# Altium project Handheld99.PrjPcb (part 2 of 3)

## Sheet RADIO.SchDoc: uBlox Radio
size A4; Organization: Altium Limited; Address1: L3, 12a Rodborough Rd; Address2: Frenchs Forest; Address3: NSW; Address4: Australia 2086
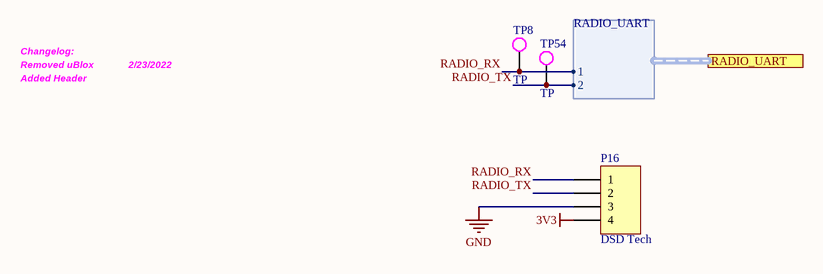
[diagram p16: RADIO.SchDoc]

### Parts
P16  DSD Tech  [HDR1X4]
TP8  TP  [Test_point]
TP54  TP  [Test_point]

### Ports
RADIO_UART (harness RADIO_UART)

### Harnesses
RADIO_UART: 1, 2

### Nets
3V3: P16.4
GND: P16.3
RADIO_RX: P16.1 TP8.1 ; port RADIO_UART.1
RADIO_TX: P16.2 TP54.1 ; port RADIO_UART.2

### Notes on the sheet
- Changelog:
- Removed uBlox
- Added Header
- 2/23/2022
- Title
- Date:
- RE:
- Arturo di Girolamo
- Size:
- A3
- A

### Library data of the parts
P16 = Header 4: Header, 4-Pin; LatestRevisionDate: 17-Jul-2002; LatestRevisionNote: Re-released for DXP Platform.; Publisher: Altium Limited
TP8 TP54 = TP_PCB: Test Point

## Sheet LOINA.SchDoc: DDS INA
size A4; Organization: Altium Limited; Address1: L3, 12a Rodborough Rd; Address2: Frenchs Forest; Address3: NSW; Address4: Australia 2086
Used 4 times, as channels LO1_INA1, LO1_INA2, LO2_INA1, LO2_INA2. Parts and nets are listed once, with the designators drawn on the sheet.
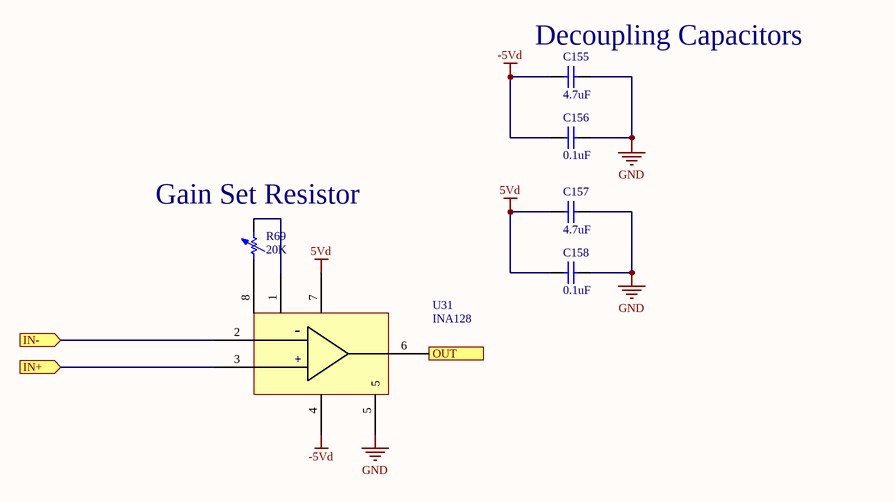
[diagram p17: LOINA.SchDoc]

### Parts
C155  4.7uF  [0402_Cap]
C156  0.1uF  [0402_Cap]
C157  4.7uF  [0402_Cap]
C158  0.1uF  [0402_Cap]
R69  20K  [TRIMRES]
U31  INA128  [SOIC_8]

### Ports
IN+ (in), IN- (in), OUT (out)

### Nets
5Vd: C157.1 C158.1 U31.7
-5Vd: C155.1 C156.1 U31.4
GND: C155.2 C156.2 C157.2 C158.2 U31.5
IN+: U31.3 ; port IN+
IN-: U31.2 ; port IN-
OUT: U31.6 ; port OUT
NetR69_1: R69.1 U31.8(Gain)
NetR69_2: R69.2 U31.1(Gain)

### Channels
LO1_INA1: designators end in _LO1_INA1; ports IN+=NetR28_LO1_1 IN-=NetR29_LO1_1 OUT=NetJ5_07
LO1_INA2: designators end in _LO1_INA2; ports IN+=NetR19_LO1_1 IN-=NetR27_LO1_1 OUT=NetR18_2
LO2_INA1: designators end in _LO2_INA1; ports IN+=NetR28_LO2_1 IN-=NetR29_LO2_1 OUT=NetJ5_08
LO2_INA2: designators end in _LO2_INA2; ports IN+=NetR19_LO2_1 IN-=NetR27_LO2_1 OUT=NetR17_2

### Notes on the sheet
- (near C155) Decoupling Capacitors
- (near R69) Gain Set Resistor
- Title
- Date:
- RE:
- Arturo di Girolamo
- Size:
- A3
- A
- (in symbol INA128UA/2K5) -; +

### Library data of the parts
C155 C157 = CL21A475KAQNNNE: as C42 on sheet buffer; MFGPN: CL21A475KAQNNNE
C156 C158 = CL21B104KACNNNC: as C1 on sheet mcu; MFGPN: CL21B104KACNNNC
R69 = PV36W102C01B00_RES: Variable resistor 1k; MFGPN: PV36W102C01B00
U31 = INA128UA/2K5: Instrumentation Amp, Generic; ASYPN: INA828IDR; MFGPN: INA128UA/2K5

## Sheet 50Hz_GEN_LPF.SchDoc: 50 Hz Sine Gen LPF
size A4; Organization: Altium Limited; Address1: L3, 12a Rodborough Rd; Address2: Frenchs Forest; Address3: NSW; Address4: Australia 2086
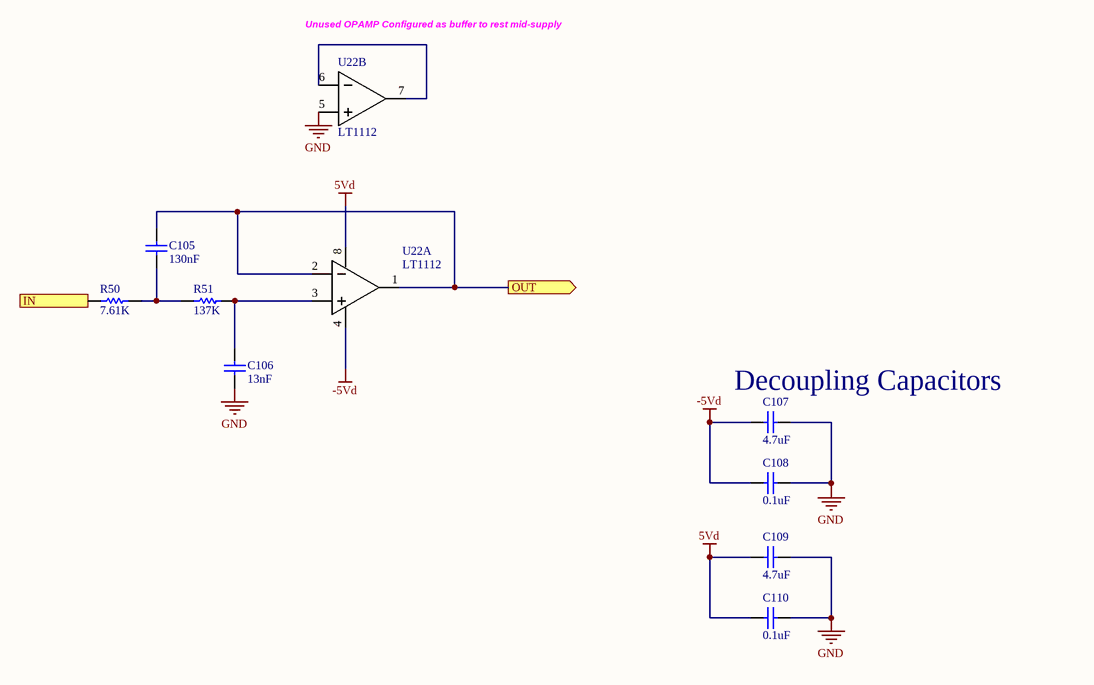
[diagram p18: 50Hz_GEN_LPF.SchDoc]

### Parts
C105  130nF  [0402_Cap]
C106  13nF  [0402_Cap]
C107  4.7uF  [0402_Cap]
C108  0.1uF  [0402_Cap]
C109  4.7uF  [0402_Cap]
C110  0.1uF  [0402_Cap]
R50  7.61K  [0402_Res]
R51  137K  [0402_Res]
U22  LT1112  [SOIC_8]  (parts A,B of 2)

### Ports
IN (in), OUT (out)

### Nets
5Vd: C109.1 C110.1 U22.8
-5Vd: C107.1 C108.1 U22.4
GND: C106.1 C107.2 C108.2 C109.2 C110.2 U22.5
NetC105_1: C105.1 R50.2 R51.1
NetC105_2: C105.2 U22.1 U22.2 ; port OUT
NetC106_2: C106.2 R51.2 U22.3
NetR17_1: R50.1 ; port IN
NetU22_6: U22.6 U22.7

### Notes on the sheet
- Unused OPAMP Configured as buffer to rest mid-supply
- (near C107) Decoupling Capacitors
- Title
- Date:
- RE:
- Arturo di Girolamo
- Size:
- A3
- A

### Library data of the parts
C105 = 08051C163JAT2A: Capacitor, 16nF, 0805, 25V; ASYPN: GRM155R61A124KE19D; Value: 16nF; MFGPN: 08051C163JAT2A
C106 = GRM2165C2A162JA01D: Capacitor, 1.6nF, 0805, 25V; ASYPN: C0402C123K8PACTU; Value: 1.6nF; MFGPN: GRM2165C2A162JA01D
C107 C109 = CL21A475KAQNNNE: as C42 on sheet buffer; MFGPN: CL21A475KAQNNNE
C108 C110 = CL21B104KACNNNC: as C1 on sheet mcu; MFGPN: CL21B104KACNNNC
R50 = RC0805FR-071K65L: 1.65k; ASYPN: MCS0402MD7501BE100; Value: 1.65k; MFGPN: RC0805FR-071K65L
R51 = RC0805FR-075K9L: 5.9k; ASYPN: RMCF0402FT137K; Value: 5.9k; MFGPN: RC0805FR-075K9L
U22 = LT1112: ASYPN: LT1112IS8#PBF

## Sheet 5kHz_GEN_LPF.SchDoc: 5kHz Sine Gen LPF
size A4; Organization: Altium Limited; Address1: L3, 12a Rodborough Rd; Address2: Frenchs Forest; Address3: NSW; Address4: Australia 2086
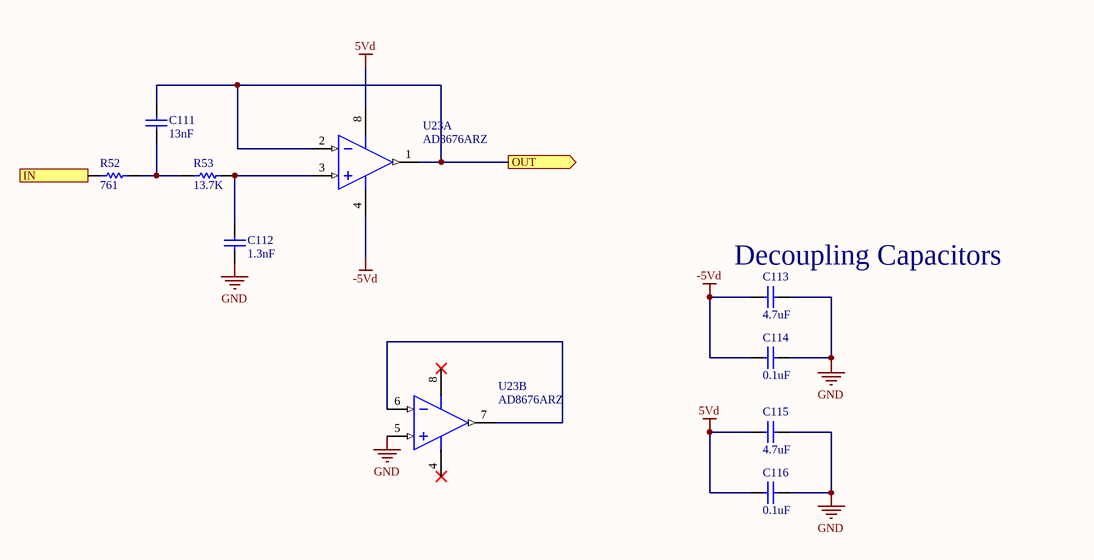
[diagram p19: 5kHz_GEN_LPF.SchDoc]

### Parts
C111  13nF  [0402_Cap]
C112  1.3nF  [0402_Cap]
C113  4.7uF  [0402_Cap]
C114  0.1uF  [0402_Cap]
C115  4.7uF  [0402_Cap]
C116  0.1uF  [0402_Cap]
R52  761  [0402_Res]
R53  13.7K  [0402_Res]
U23  AD8676ARZ  [ADI-R-8_M]  (parts A,B of 2)

### Ports
IN (in), OUT (out)

### Nets
5Vd: C115.1 C116.1 U23.8(+V)
-5Vd: C113.1 C114.1 U23.4(-V)
GND: C112.1 C113.2 C114.2 C115.2 C116.2 U23.5(+IN_B)
NetC111_1: C111.1 R52.2 R53.1
NetC111_2: C111.2 U23.1(OUT_A) U23.2(-IN_A) ; port OUT
NetC112_2: C112.2 R53.2 U23.3(+IN_A)
NetR18_1: R52.1 ; port IN
NetU23_6: U23.6(-IN_B) U23.7(OUT_B)

### Notes on the sheet
- (near C113) Decoupling Capacitors
- Title
- Date:
- RE:
- Arturo di Girolamo
- Size:
- A3
- A

### Library data of the parts
C111 = 08051C163JAT2A: Capacitor, 16nF, 0805, 25V; ASYPN: C0402C123K8PACTU; Value: 16nF; MFGPN: 08051C163JAT2A
C112 = GRM2165C2A162JA01D: Capacitor, 1.6nF, 0805, 25V; ASYPN: GRM1557U1A122JA01D; Value: 1.6nF; MFGPN: GRM2165C2A162JA01D
C113 C115 = CL21A475KAQNNNE: as C42 on sheet buffer; MFGPN: CL21A475KAQNNNE
C114 C116 = CL21B104KACNNNC: as C1 on sheet mcu; MFGPN: CL21B104KACNNNC
R52 = RC0805FR-071K65L: 1.65k; ASYPN: ERA-2AEB7680X; Value: 1.65k; MFGPN: RC0805FR-071K65L
R53 = RC0805FR-075K9L: 5.9k; ASYPN: RMCF0402FT13K7; Value: 5.9k; MFGPN: RC0805FR-075K9L
U23 = CMP-0384-01145-2: Double Channel Wide Bandwidth Operational Amplifier, 10 MHz BW, 2.5 V/us SR, Industrial, 8-pin SOIC (R-8), Tube; Generic Part Number: AD8676; Manufacturer: Analog Devices; Input Offset Voltage: 12uV; Input Bias Current: 2.4nA; V Span Min: 10V; Iq/Amp: 2.7mA; V Span Max: 36V; Small Signal Bandwidth: 10MHz; Amplifiers Per Package: 2; Code_JEDEC: MS-012-AA; Mounting Technology: Surface Mount; Slew Rate: 2.5V/us; DatasheetVersion: Rev. C; ComponentLink2Description: Datasheet; ComponentLink3Description: Package Specification; PackageReference: R-8; ComponentLink1URL: http://www.analog.com/en/index.html; RevisionNote: Reference Circuit URL fixed; ComponentLink1Description: Manufacturer URL; ComponentLink2URL: http://www.analog.com/static/imported-files/data_sheets/AD8676.pdf; ComponentLink3URL: http://www.analog.com/static/imported-files/packages/PKG_PDF/SOIC_Narrow%20(R)/R_8.pdf; ComponentLink4Description: Reference Circuit; ComponentLink4URL: http://www.analog.com/en/all-operational-amplifiers-op-amps/operational-amplifiers-op-amps/ad8676/products/product.html#product-recommendations; PackageDescription: 8-Pin Standard Small Outline Package, Body 3.9 x 4.9 mm, Pitch 1.27 mm; PartNumber: AD8676ARZ; PackageVersion: 060506-A; ASYPN: AD8676ARZ

## Sheet low_pass.SchDoc: 4TH ORDER LOWPASS
size A4; Organization: Altium Limited; Address1: L3, 12a Rodborough Rd; Address2: Frenchs Forest; Address3: NSW; Address4: Australia 2086; DocumentNumber: 1; Revision: 1
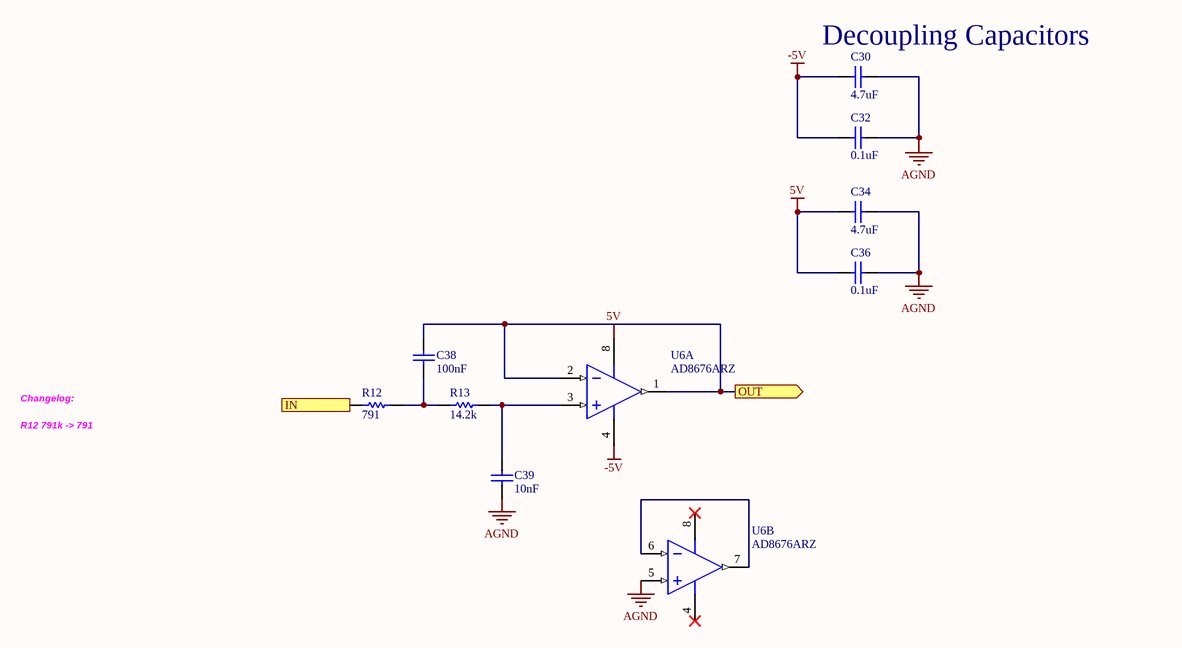
[diagram p20: low_pass.SchDoc]

### Parts
C30  4.7uF  [0402_Cap]
C32  0.1uF  [0402_Cap]
C34  4.7uF  [0402_Cap]
C36  0.1uF  [0402_Cap]
C38  100nF  [0402_Cap]
C39  10nF  [0402_Cap]
R12  791  [0402_Res]
R13  14.2k  [0402_Res]
U6  AD8676ARZ  [ADI-R-8_M]  (parts A,B of 2)

### Ports
IN (in), OUT (out)

### Nets
5V: C34.1 C36.1 U6.8(+V)
-5V: C30.1 C32.1 U6.4(-V)
AGND: C30.2 C32.2 C34.2 C36.2 C39.1 U6.5(+IN_B)
NetC38_1: C38.1 R12.2 R13.1
NetC38_2: C38.2 U6.1(OUT_A) U6.2(-IN_A) ; port OUT
NetC39_2: C39.2 R13.2 U6.3(+IN_A)
NetR10_HP2_2: R12.1 ; port IN
NetU6_6: U6.6(-IN_B) U6.7(OUT_B)

### Notes on the sheet
- (near C30) Decoupling Capacitors
- Changelog:
- R12 791k -> 791
- Title
- Date:
- RE:
- Arturo di Girolamo
- Size:
- A3
- A

### Library data of the parts
C30 C34 = CL21A475KAQNNNE: as C42 on sheet buffer; MFGPN: CL21A475KAQNNNE
C32 C36 = CL21B104KACNNNC: as C1 on sheet mcu; MFGPN: CL21B104KACNNNC
C38 = 08051C163JAT2A: Capacitor, 16nF, 0805, 25V; ASYPN: 0402YC104KAT2A; Value: 16nF; MFGPN: 08051C163JAT2A
C39 = GRM2165C2A162JA01D: Capacitor, 1.6nF, 0805, 25V; ASYPN: 0402B103K6R3CT; Value: 1.6nF; MFGPN: GRM2165C2A162JA01D
R12 = RC0805FR-071K65L: 1.65k; ASYPN: RMCF0402FT787K; Value: 1.65k; MFGPN: RC0805FR-071K65L
R13 = RC0805FR-075K9L: 5.9k; ASYPN: TNPW040214K2BEED; Value: 5.9k; MFGPN: RC0805FR-075K9L
U6 = CMP-0384-01145-2: as U23 on sheet 5kHz_GEN_LPF; Code_JEDEC: MS-012-AA; Mounting Technology: Surface Mount; Slew Rate: 2.5V/us; DatasheetVersion: Rev. C; ComponentLink2Description: Datasheet; ComponentLink3Description: Package Specification; PackageReference: R-8; ComponentLink1URL: http://www.analog.com/en/index.html; RevisionNote: Reference Circuit URL fixed; ComponentLink1Description: Manufacturer URL; ComponentLink2URL: http://www.analog.com/static/imported-files/data_sheets/AD8676.pdf; ComponentLink3URL: http://www.analog.com/static/imported-files/packages/PKG_PDF/SOIC_Narrow%20(R)/R_8.pdf; ComponentLink4Description: Reference Circuit; ComponentLink4URL: http://www.analog.com/en/all-operational-amplifiers-op-amps/operational-amplifiers-op-amps/ad8676/products/product.html#product-recommendations; PackageDescription: 8-Pin Standard Small Outline Package, Body 3.9 x 4.9 mm, Pitch 1.27 mm; PartNumber: AD8676ARZ; PackageVersion: 060506-A; ASYPN: AD8676ARZ

## Sheet 3v3_Regulator.SchDoc: 3.3 Regulator
size A4; Organization: Altium Limited; Address1: L3, 12a Rodborough Rd; Address2: Frenchs Forest; Address3: NSW; Address4: Australia 2086
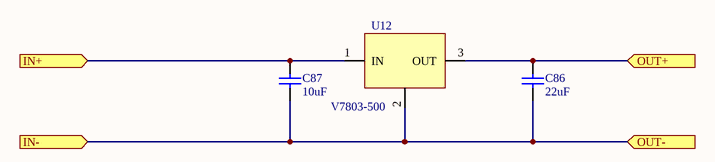
[diagram p21: 3v3_Regulator.SchDoc]

### Parts
C86  22uF  [STD_0805_C]
C87  10uF  [STD_0805_C]
U12  V7803-500  [V78-500]

### Ports
IN+ (in), IN- (in), OUT+ (in), OUT- (in)

### Nets
3V3: C86.2 U12.3(OUT) ; port OUT+
24V: C87.2 U12.1(IN) ; port IN+
GND: C86.1 C87.1 U12.2(GND) ; port IN-, port OUT-

### Notes on the sheet
- Title
- Date:
- RE:
- Arturo di Girolamo
- Size:
- A3
- A

### Library data of the parts
C86 C87 = GRM21BR61E226ME44L: Capacitor, 22uF, 0805, 25V; Value: .01uf; ASYPN: C2012X5R1V226M125AC; MFGPN: GRM21BR61E226ME44L

## Sheet ADC_Reference.SchDoc: ADC Reference
size A4; Organization: Altium Limited; Address1: L3, 12a Rodborough Rd; Address2: Frenchs Forest; Address3: NSW; Address4: Australia 2086
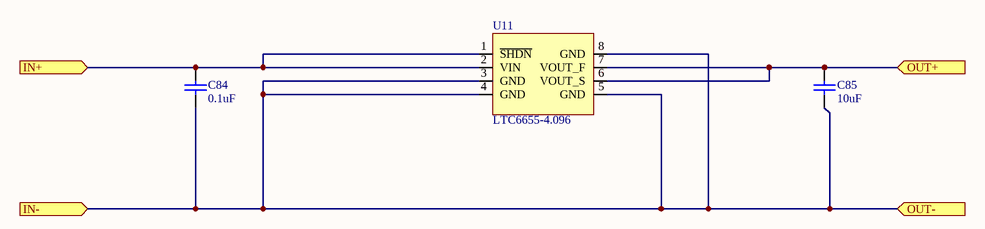
[diagram p22: ADC_Reference.SchDoc]

### Parts
C84  0.1uF  [0402_Cap]
C85  10uF  [0402_Cap]
U11  LTC6655-4.096  [MSOP_8]

### Ports
IN+ (in), IN- (in), OUT+ (in), OUT- (in)

### Nets
5V: C84.2 U11.1(~{SHDN}) U11.2(VIN) ; port IN+
AGND: C84.1 C85.1 U11.3(GND) U11.4(GND) U11.5(GND) U11.8(GND) ; port OUT-, port IN-
REF: C85.2 U11.6(VOUT_S) U11.7(VOUT_F) ; port OUT+

### Notes on the sheet
- Title
- Date:
- RE:
- Arturo di Girolamo
- Size:
- A3
- A

### Library data of the parts
C84 = CL21B104KACNNNC: as C1 on sheet mcu; MFGPN: CL21B104KACNNNC
C85 = CL21A106KAFN3NE: Capacitor, 10uF, 0805; Value: .01uf; ASYPN: CL05A106MQ5NUNC; MFGPN: CL21A106KAFN3NE
U11 = LTC6655CHMS8-4.096#PBF: Voltage Reference 4.096V; MFGPN: LTC6655CHMS8-4.096#PBF; ASYPN: LTC6655CHMS8-4.096#PBF

## Sheet 2v5_Regulator.SchDoc: 2.5V ADC Regulator
size A4; Organization: Altium Limited; Address1: L3, 12a Rodborough Rd; Address2: Frenchs Forest; Address3: NSW; Address4: Australia 2086
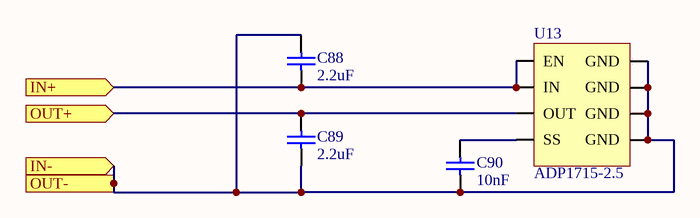
[diagram p23: 2v5_Regulator.SchDoc]

### Parts
C88  2.2uF  [0402_Cap]
C89  2.2uF  [0402_Cap]
C90  10nF  [0402_Cap]
U13  ADP1715-2.5  [MSOP_8]

### Ports
IN+ (in), IN- (in), OUT+ (in), OUT- (in)

### Nets
2V5: C89.2 U13.3(OUT) ; port OUT+
5V: C88.1 U13.1(EN) U13.2(IN) ; port IN+
AGND: C88.2 C89.1 C90.1 U13.5(GND) U13.6(GND) U13.7(GND) U13.8(GND) ; port OUT-, port IN-
NetC90_2: C90.2 U13.4(SS)

### Notes on the sheet
- Title
- Date:
- RE:
- Arturo di Girolamo
- Size:
- A3
- A

### Library data of the parts
C88 C89 = CL21A225KAFNNNE: Capacitor, 2.2uF, 0805; Value: .01uf; ASYPN: CL05A225KP5NNNC; MFGPN: CL21A225KAFNNNE
C90 = C0805C103K1RAC7210: Capacitor, 10nF, 0805; Value: .01uf; ASYPN: 0402B103K6R3CT; MFGPN: C0805C103K1RAC7210
U13 = ADP1715ARMZ-2.5-R7: 2.5V linear regulator; MFGPN: ADP1715ARMZ-2.5-R7; ASYPN: ADP1715ARMZ-2.5-R7

## Sheet 5v_Regulator.SchDoc: 5V Battery Regulator
size A4; Organization: Altium Limited; Address1: L3, 12a Rodborough Rd; Address2: Frenchs Forest; Address3: NSW; Address4: Australia 2086
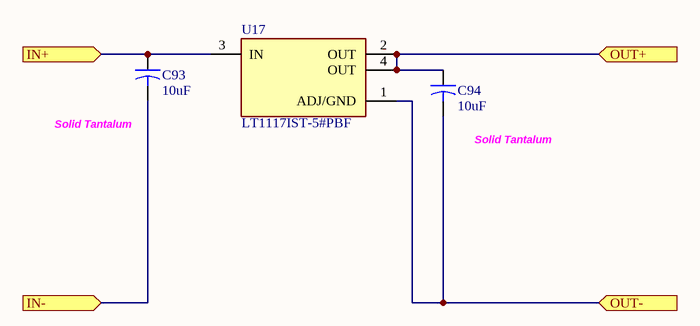
[diagram p24: 5v_Regulator.SchDoc]

### Parts
C93  10uF  [Tantalum_2917]
C94  10uF  [Tantalum_2917]
U17  LT1117IST-5#PBF  [REG_LT1117IST-5#PBF]

### Ports
IN+ (in), IN- (in), OUT+ (in), OUT- (in)

### Nets
5V: C94.1 U17.2(OUT) U17.4(OUT) ; port OUT+
AGND: C94.2 U17.1(ADJ/GND) ; port OUT-
NetC93_1: C93.1 U17.3(IN) ; port IN+
NetC93_2: C93.2 ; port IN-

### Notes on the sheet
- (near C93) Solid Tantalum
- (near C94) Solid Tantalum
- Title
- Date:
- RE:
- Arturo di Girolamo
- Size:
- A3
- A

### Library data of the parts
C93 C94 = UVR1V102MHD1TO: Capacitor, 100uF NICHICON; ASYPN: T495D106K035ATE260; MFGPN: UVR1V102MHD1TO
U17 = LT1117IST-5#PBF: LDO Regulator Pos 5V 0.8A Automotive 4-Pin_3+Tab_ SOT-223 Tube; MF: Analog Devices; Value: *; Availability: Unavailable; Price: None; MP: LT1117IST-5#PBF; Package: SOT-223-3 Analog Devices; SnapEDA_Link: https://www.snapeda.com/parts/LT1117IST-5%23PBF/Analog%20Devices/view-part/4348177/?ref=snap; ASYPN: LT1117IST-5#PBF; Parameter 1: *

## Sheet -5v_Regulator.SchDoc: -5V Battery Regulator
size A4; Organization: Altium Limited; Address1: L3, 12a Rodborough Rd; Address2: Frenchs Forest; Address3: NSW; Address4: Australia 2086
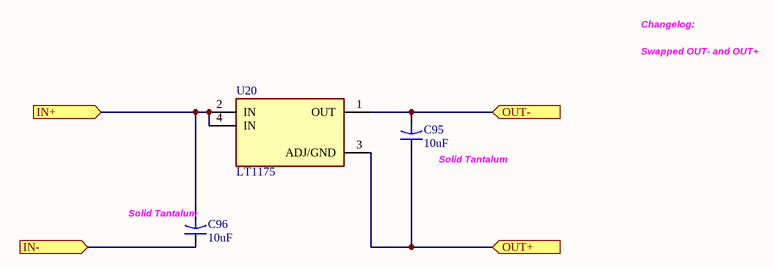
[diagram p25: -5v_Regulator.SchDoc]

### Parts
C95  10uF  [Tantalum_2917]
C96  10uF  [Tantalum_2917]
U20  LT1175  [REG_LT1117IST-5#PBF]

### Ports
IN+ (in), IN- (in), OUT+ (in), OUT- (in)

### Nets
-5V: C95.2 U20.1(OUT) ; port OUT-
AGND: C95.1 U20.3(ADJ/GND) ; port OUT+
NetC93_2: C96.2 U20.2(IN) U20.4(IN) ; port IN+
NetC96_1: C96.1 ; port IN-

### Notes on the sheet
- Changelog:
- Swapped OUT- and OUT+
- (near C95) Solid Tantalum
- (near C96) Solid Tantalum
- Title
- Date:
- RE:
- Arturo di Girolamo
- Size:
- A3
- A

### Library data of the parts
C95 C96 = UVR1V102MHD1TO: as C93 on sheet 5v_Regulator; MFGPN: UVR1V102MHD1TO
U20 = LT1175: ASYPN: LT1175IST-5#TRPBF

## Sheet Power_Input.SchDoc: Power Input PCB
size A4; Organization: Altium Limited; Address1: L3, 12a Rodborough Rd; Address2: Frenchs Forest; Address3: NSW; Address4: Australia 2086
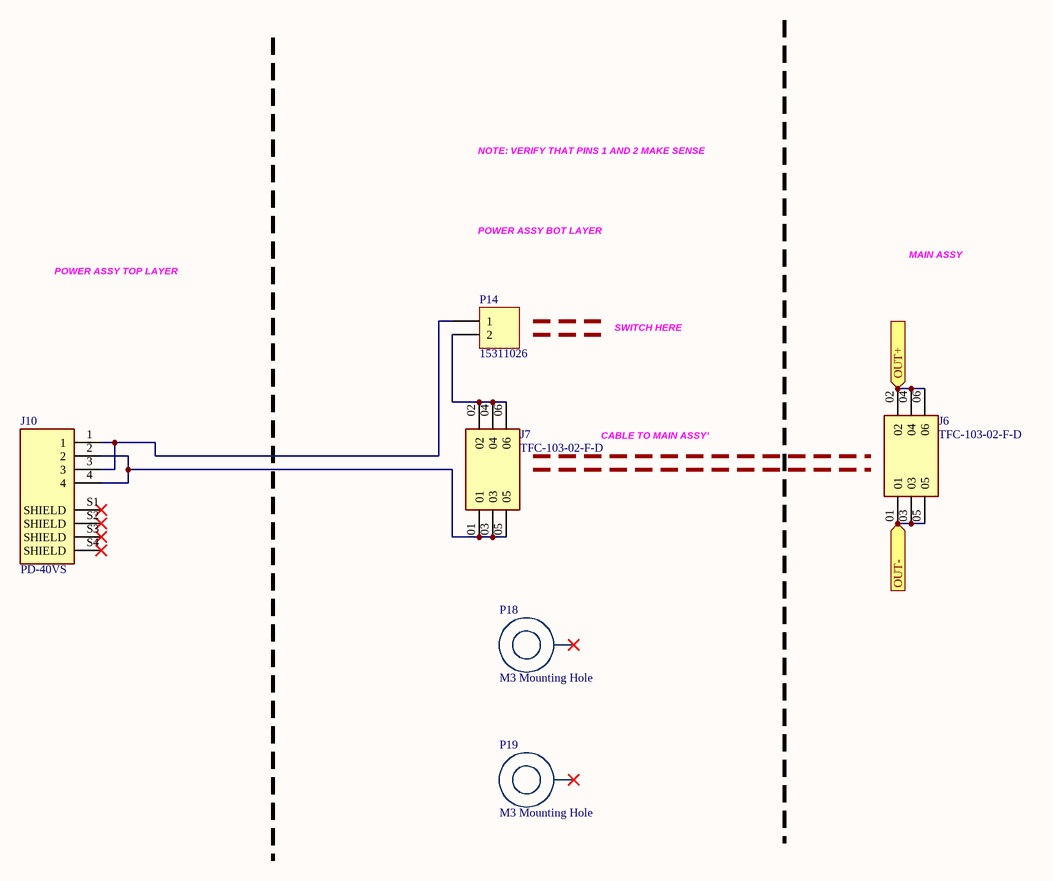
[diagram p26: Power_Input.SchDoc]

### Parts
J6  TFC-103-02-F-D  [SAMTEC_TFC-103-02-F-D]
J7  TFC-103-02-F-D  [SAMTEC_TFC-103-02-F-D]
J10  PD-40VS  [CUI_PD-40VS]
P14  15311026  [HDR1X2]
P18  M3 Mounting Hole  [MH-M3]
P19  M3 Mounting Hole  [MH-M3]

### Ports
OUT+ (in), OUT- (in)

### Nets
GND: J6.01 J6.03 J6.05 ; port OUT-
NetC130_Negative_DC-DC#1_2: J6.02 J6.04 J6.06 ; port OUT+
NetJ7_01: J7.01 J7.03 J7.05 J10.2 J10.4
NetJ7_02: J7.02 J7.04 J7.06 P14.2
NetJ10_1: J10.1 J10.3 P14.1

Not connected (* = marked no-connect by the designer): J10 S1(SHIELD)* S2(SHIELD)* S3(SHIELD)* S4(SHIELD)*; P18 1*; P19 1*

### Notes on the sheet
- NOTE: VERIFY THAT PINS 1 AND 2 MAKE SENSE
- POWER ASSY BOT LAYER
- MAIN ASSY
- POWER ASSY TOP LAYER
- SWITCH HERE
- CABLE TO MAIN ASSY'
- Title
- Date:
- RE:
- Arturo di Girolamo
- Size:
- A3
- A

### Library data of the parts
J6 J7 = TFC-103-02-F-D: MF: Samtec; Value: *; Availability: Unavailable; MP: TFC-103-02-F-D; Price: None; Package: None; ASYPN: TFC-103-02-F-D
J10 = PD-40VS: 4 Position , 7.5 A, Vertical, Through Hole, Shielded, Power DIN Connector; MF: {'manufacturer': u'CUI'}; MP: PD-40VS; Package: None; Price: None; Availability: Unavailable; Value: *
P14 = Header 2: Header, 2-Pin; LatestRevisionDate: 17-Jul-2002; LatestRevisionNote: Re-released for DXP Platform.; Publisher: Altium Limited
P18 P19 = MH-M3

## Sheet Batt_Charger.SchDoc: Battery Charging
size A4; Organization: Altium Limited; Address1: L3, 12a Rodborough Rd; Address2: Frenchs Forest; Address3: NSW; Address4: Australia 2086
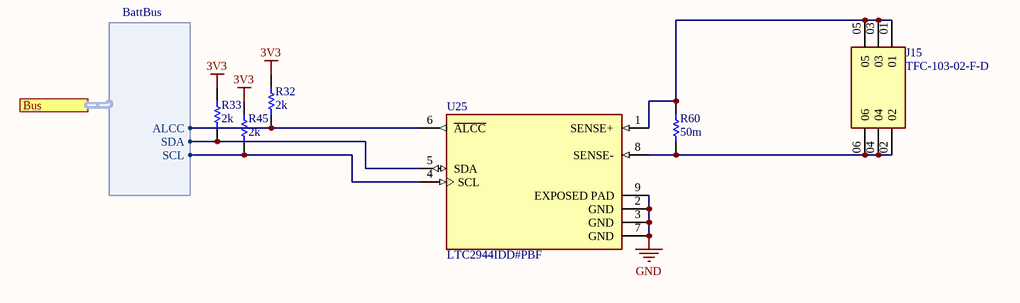
[diagram p27: Batt_Charger.SchDoc]

### Parts
J15  TFC-103-02-F-D  [SAMTEC_TFC-103-02-F-D]
R32  2k  [0402_Res]
R33  2k  [0402_Res]
R45  2k  [0402_Res]
R60  50m  [STD_0805_R]
U25  LTC2944IDD#PBF  [FP-DD-8-05-08-1698-MFG]

### Ports
Bus (harness BattBus)

### Harnesses
BattBus: ALCC, SDA, SCL

### Nets
3V3: R32.2 R33.2 R45.2
GND: U25.2(GND) U25.3(GND) U25.7(GND) U25.9(EXPOSED_PAD)
ALCC: R32.1 U25.6(~{ALCC}) ; port Bus.ALCC
SCL: R45.1 U25.4(SCL) ; port Bus.SCL
SDA: R33.1 U25.5(SDA) ; port Bus.SDA
NetJ15_01: J15.01 J15.03 J15.05 R60.2 U25.1(SENSE+)
NetJ15_02: J15.02 J15.04 J15.06 R60.1 U25.8(SENSE-)

### Notes on the sheet
- Title
- Date:
- RE:
- Arturo di Girolamo
- Size:
- A3
- A

### Library data of the parts
J15 = TFC-103-02-F-D: MF: Samtec; Value: *; Availability: Unavailable; MP: TFC-103-02-F-D; Price: None; Package: None; ASYPN: TFC-103-02-F-D
R32 R33 R45 = RNCP0805FTD1K00: 1K 1% 1/4W; ASYPN: RMCF0402FT2K00; Value: 1K; MFGPN: RNCP0805FTD1K00
R60 = RNCP0805FTD1K00: 1K 1% 1/4W; ASYPN: UR73V2ATTD50L0F; Value: 1K; MFGPN: RNCP0805FTD1K00
U25 = CMP-09132-000003-1: IC BATTERY GAS GAUGE I2C 8DFN; Manufacturer: Analog Devices; Nominal Supply Current: 15-850uA; Max Supply Voltage: 60V; Number Of Cells: 1; Standoff Height: 0mm; Min Supply Voltage: 3.6V; Package: DD-8-05-08-1698; Mouser Description: LTC2944 - 60V Battery Gas Gauge with Temperature, Voltage and Current Measurement; Digikey Description: IC BATTERY GAS GAUGE I2C 8DFN; Device Class L1: Integrated Circuits (ICs); Automotive: No; Height: 0.8mm; Temperature: -40°C to +85°C; ComponentLink2Description: Datasheet; Number Of Outputs: 1; Octopart: https://octopart.com/ltc2944idd%23pbf-analog+devices-88318751; Ipc Land Pattern Name: DFN300X300X75-8; Temperature Range Low: -40°C; Lead Free: Yes; ComponentLink2URL: https://www.analog.com/media/en/technical-documentation/data-sheets/2944fa.pdf; Ambient Temperature Range Low: -40°C; Device Class L3: Battery Management; Category: IC; RoHS: TRUE; Manufacturer Part Number: LTC2944IDD#PBF; Ambient Temperature Range High: +85°C; Temperature Range High: +85°C; Device Class L2: Power Management ICs; ASYPN: LTC2944IDD#PBF

## Sheet Large_Relay.SchDoc: High Current Relay
size A4; Organization: Altium Limited; Address1: L3, 12a Rodborough Rd; Address2: Frenchs Forest; Address3: NSW; Address4: Australia 2086
Used 3 times, as channels Large Relay 1, Large Relay 2, Large Relay 3. Parts and nets are listed once, with the designators drawn on the sheet.
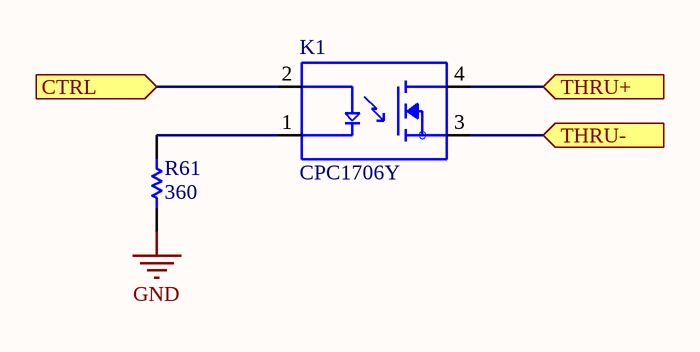
[diagram p28: Large_Relay.SchDoc]

### Parts
K1  CPC1706Y  [RELAY_CPC1706Y]
R61  360  [0402_Res]

### Ports
CTRL (in), THRU+ (in), THRU- (in)

### Nets
GND: R61.1
CTRL: K1.2 ; port CTRL
THRU+: K1.4 ; port THRU+
THRU-: K1.3 ; port THRU-
NetK1_1: K1.1 R61.2

### Channels
Large Relay 1: designators end in _Large_Relay_1; ports CTRL=NetK1_Large_Relay_1_2 THRU+=-24V_548_HF THRU-=-24V_HF
Large Relay 2: designators end in _Large_Relay_2; ports CTRL=NetK1_Large_Relay_2_2 THRU+=24V THRU-=24V_548
Large Relay 3: designators end in _Large_Relay_3; ports CTRL=NetK1_Large_Relay_3_2 THRU+=-24V_548_LF THRU-=-24V_LF

### Notes on the sheet
- Title
- Date:
- RE:
- Arturo di Girolamo
- Size:
- A3
- A

### Library data of the parts
K1 = CPC1706Y: Solid State SPST-NO _1 Form A_ 8-SIP, 4 Leads; MF: IXYS Integrated; MP: CPC1706Y; Value: *; Package: SIP-4 IXYS; SnapEDA_Link: https://www.snapeda.com/parts/CPC1706Y/IXYS%20Integrated%20Circuits%20Division/view-part/681572/?ref=snap; Price: None; Availability: Unavailable
R61 = ERJ-PB6D7501V: 7.5K 1% 1/4W; Value: 1K; ASYPN: ERJ-2GEJ361X; MFGPN: ERJ-PB6D7501V

## Sheet Small_Relay.SchDoc: Low Current Relay
size A4; Organization: Altium Limited; Address1: L3, 12a Rodborough Rd; Address2: Frenchs Forest; Address3: NSW; Address4: Australia 2086
Used 2 times, as channels Small Relay 1, Small Relay 2. Parts and nets are listed once, with the designators drawn on the sheet.
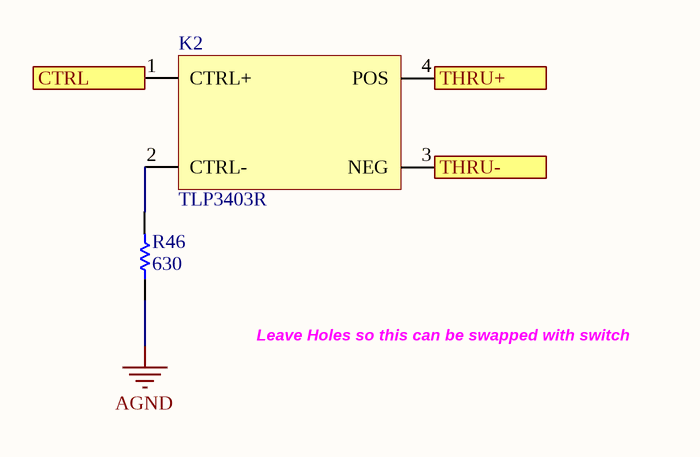
[diagram p29: Small_Relay.SchDoc]

### Parts
K2  TLP3403R  [VSONR4]
R46  630  [0402_Res]

### Ports
CTRL (in), THRU+ (in), THRU- (in)

### Nets
AGND: R46.1
CTRL: K2.1(CTRL+) ; port CTRL
THRU+: K2.4(POS) ; port THRU+
THRU-: K2.3(NEG) ; port THRU-
NetK2_2: K2.2(CTRL-) R46.2

### Channels
Small Relay 1: designators end in _Small_Relay_1; ports CTRL=NetJ9_01 THRU+=NetJ14_02 THRU-=NetC93_1
Small Relay 2: designators end in _Small_Relay_2; ports CTRL=NetJ9_02 THRU+=NetC96_1 THRU-=NetJ2_3

### Notes on the sheet
- Leave Holes so this can be swapped with switch
- Title
- Date:
- RE:
- Arturo di Girolamo
- Size:
- A3
- A

### Library data of the parts
R46 = ERJ-PB6D7501V: 7.5K 1% 1/4W; Value: 1K; ASYPN: RK73B1ETTP621J; MFGPN: ERJ-PB6D7501V
K2 = TLP3403R: ASYPN: TLP3403R

## Sheet 7419_SUPPLY.SchDoc: 7419 Ckt
size A3; Organization: Altium Limited; Address1: L3, 12a Rodborough Rd; Address2: Frenchs Forest; Address3: NSW; Address4: Australia 2086
Used 2 times, as channels Negative DC-DC, Negative DC-DC. Parts and nets are listed once, with the designators drawn on the sheet.
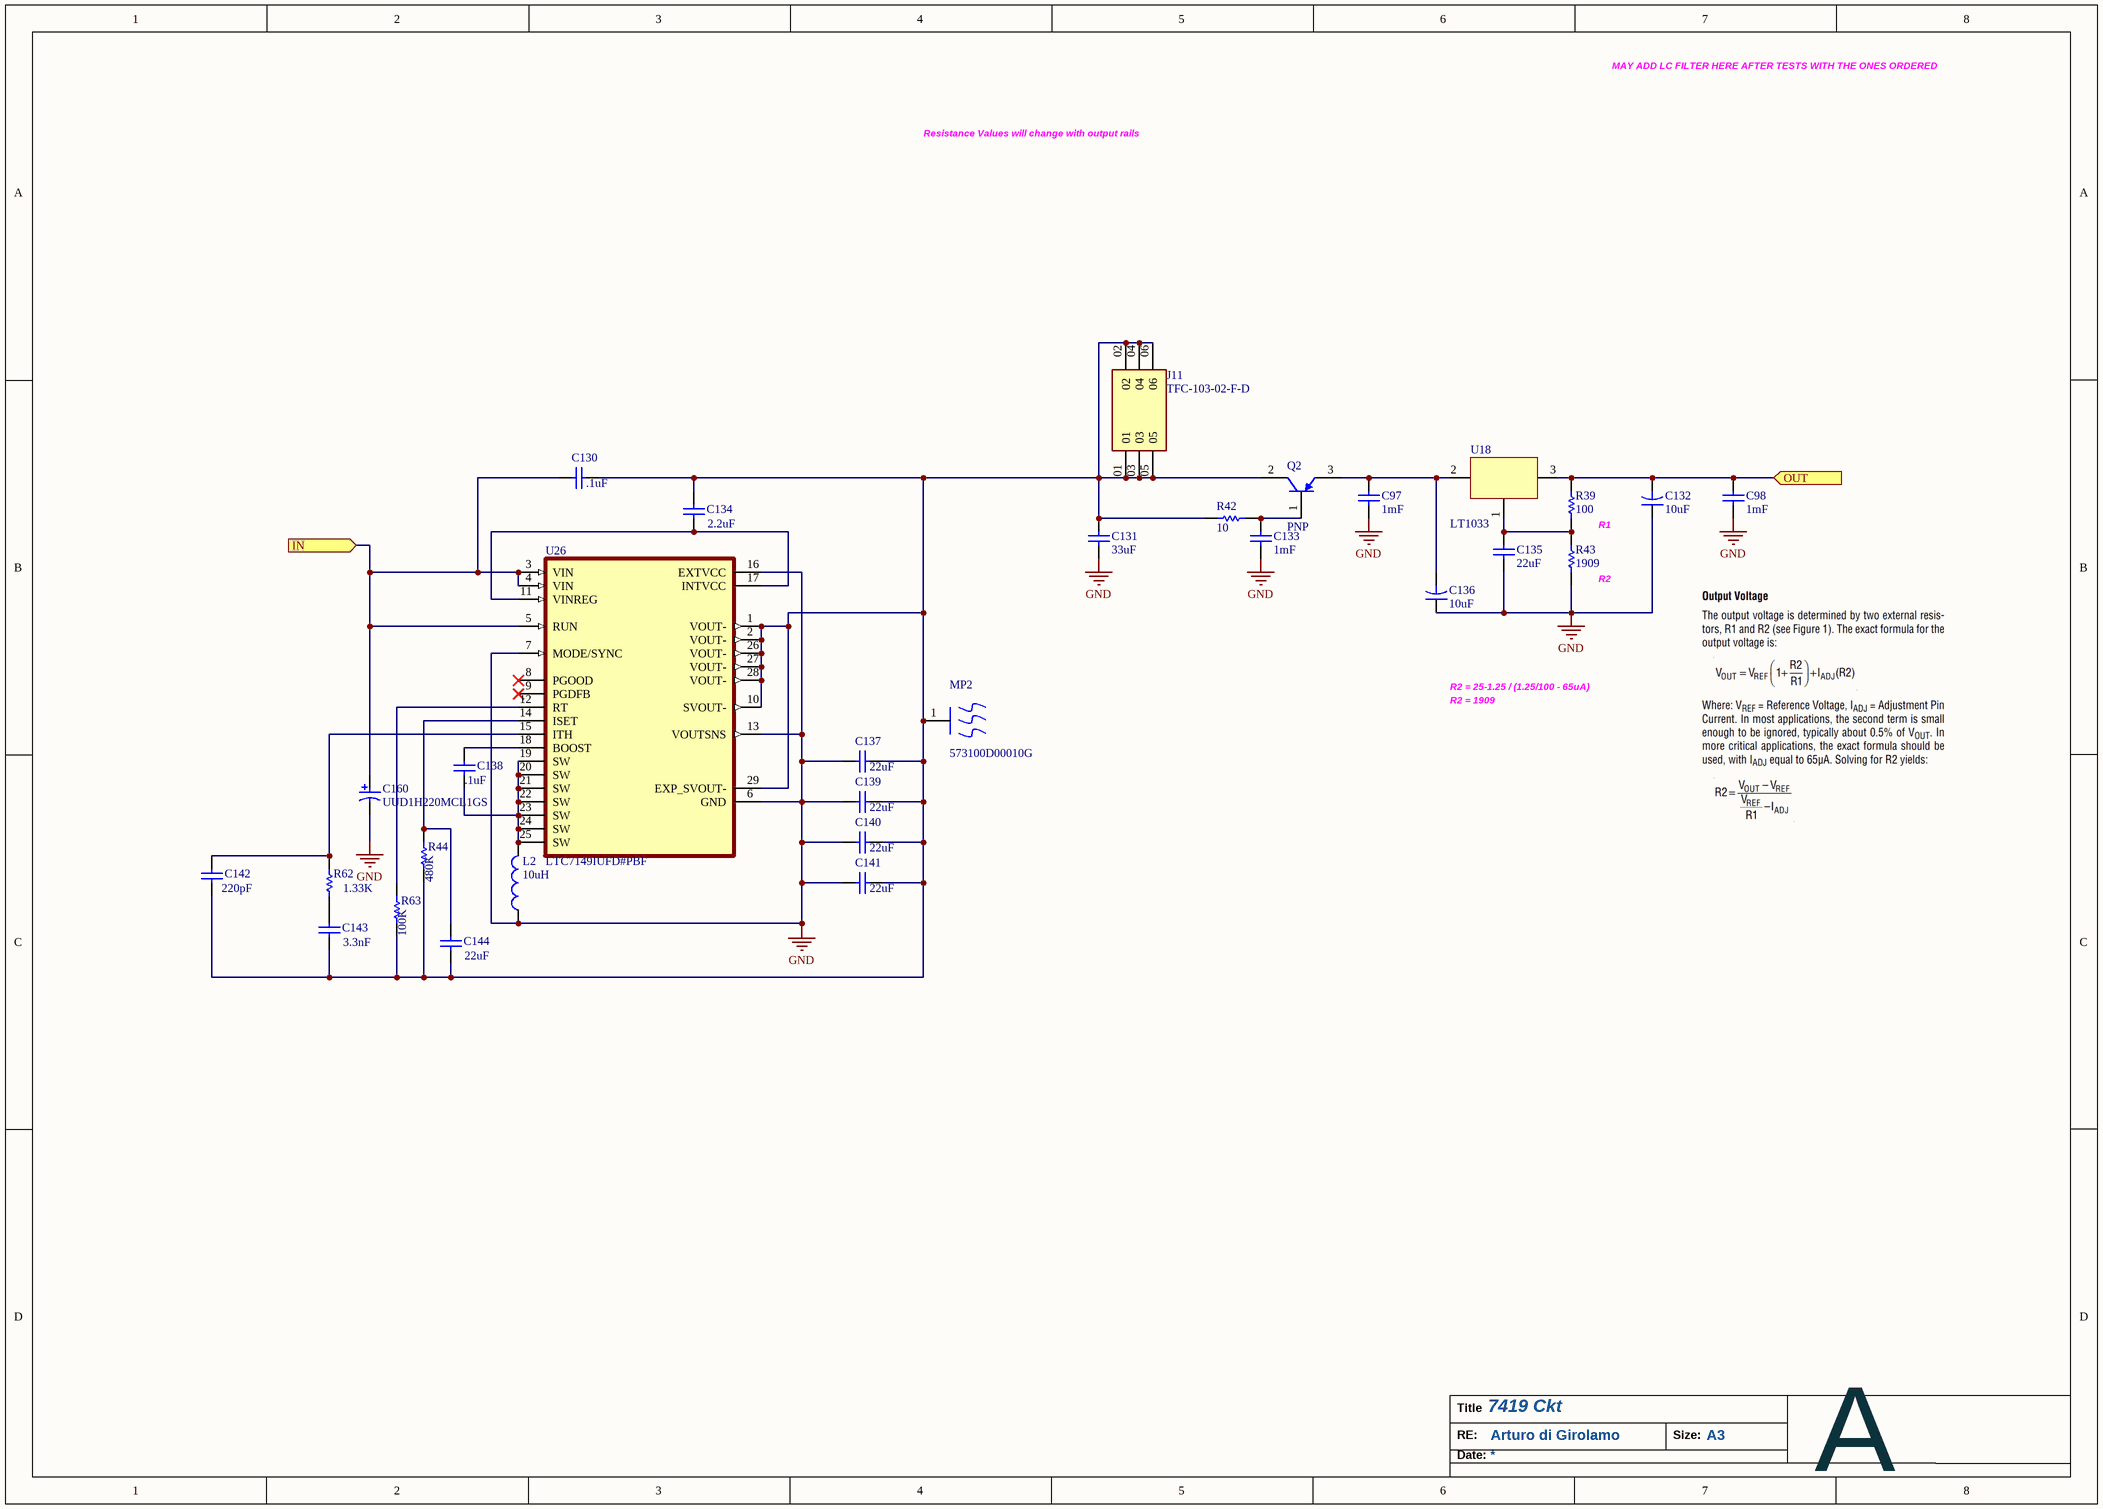
[diagram p30: 7419_SUPPLY.SchDoc]

### Parts
C97  1mF  [EEVFK1V152M]
C98  1mF  [EEVFK1V152M]
C130  value .1uF  [6-0805_M]  (hidden comment: 478-10836-1-ND)
C131  value 33uF  [6-0805_M]  (hidden comment: 490-10749-1-ND)
C132  10uF  [Tantalum_2917]
C133  1mF  [EEVFK1V152M]
C134  value 2.2uF  [6-0805_M]  (hidden comment: 1276-6458-1-ND)
C135  value 22uF  [6-0805_M]  (hidden comment: 490-10749-1-ND)
C136  10uF  [Tantalum_2917]
C137  value 22uF  [6-0805_M]  (hidden comment: 490-10749-1-ND)
C138  value .1uF  [6-0805_M]  (hidden comment: 478-10836-1-ND)
C139  value 22uF  [6-0805_M]  (hidden comment: 490-10749-1-ND)
C140  value 22uF  [6-0805_M]  (hidden comment: 490-10749-1-ND)
C141  value 22uF  [6-0805_M]  (hidden comment: 490-10749-1-ND)
C142  value 220pF  [6-0805_M]  (hidden comment: 399-1151-1-ND)
C143  value 3.3nF  [6-0805_M]  (hidden comment: 399-1153-1-ND)
C144  value 22uF  [6-0805_M]  (hidden comment: 399-7994-1-ND)
C160  UUD1H220MCL1GS  [NIC-CAPA2-6.3X5.8_V]
J11  TFC-103-02-F-D  [SAMTEC_TFC-103-02-F-D]
L2  10uH  [IHLP2020BZER100M01]
MP2  573100D00010G  [FP-573100D00010G-MFG]
Q2  PNP  [TO-220-3]
R39  100  [2512_SMD]
R42  10  [2512_SMD]
R43  1909  [2512_SMD]
R44  value 480K  [6-0805_M]  (hidden comment: 311-360KCRCT-ND)
R62  value 1.33K  [6-0805_M]  (hidden comment: P20607CT-ND)
R63  value 100K  [6-0805_M]  (hidden comment: P100KCCT-ND)
U18  LT1033  [TO-220-3]
U26  LTC7149IUFD#PBF  [QFN50P500X400X80-29N]

### Ports
IN (in), OUT (in)

### Nets
GND: C97.1 C98.1 C131.2 C132.1 C133.1 C135.2 C136.1 C137.2 C139.2 C140.2 C141.2 C160.2 L2.1 R43.1 U26.6(GND) U26.7(MODE/SYNC) U26.13(VOUTSNS) U26.16(EXTVCC)
IN: C130.2 C160.1 U26.3(VIN) U26.4(VIN) U26.5(RUN) ; port IN
OUT: C98.2 C132.2 R39.2 U18.3 ; port OUT
NetC97_2: C97.2 C136.2 Q2.3(E) U18.2
NetC130_1: C130.1 C131.1 C134.2 C137.1 C139.1 C140.1 C141.1 C142.2 C143.2 C144.2 J11.01 J11.02 J11.03 J11.04 J11.05 J11.06 MP2.1 Q2.2(C) R42.1 R44.1 R63.1 U26.1(VOUT-) U26.2(VOUT-) U26.10(SVOUT-) U26.26(VOUT-) U26.27(VOUT-) U26.28(VOUT-) U26.29(EXP_SVOUT-)
NetC133_2: C133.2 Q2.1(B) R42.2
NetC134_1: C134.1 U26.11(VINREG) U26.17(INTVCC)
NetC135_1: C135.1 R39.1 R43.2 U18.1
NetC138_1: C138.1 U26.18(BOOST)
NetC138_2: C138.2 L2.2 U26.19(SW) U26.20(SW) U26.21(SW) U26.22(SW) U26.23(SW) U26.24(SW) U26.25(SW)
NetC142_1: C142.1 R62.2 U26.15(ITH)
NetC143_1: C143.1 R62.1
NetC144_1: C144.1 R44.2 U26.14(ISET)
NetR63_2: R63.2 U26.12(RT)

Not connected (* = marked no-connect by the designer): U26 8(PGOOD)* 9(PGDFB)*

### Channels
Negative DC-DC: designators end in _Negative_DC-DC#1; ports IN=NetC130_Negative_DC-DC#1_2 OUT=NetC98_Negative_DC-DC#1_2
Negative DC-DC: designators end in _Negative_DC-DC#2; ports IN=NetC130_Negative_DC-DC#1_2 OUT=NetC98_Negative_DC-DC#2_2

### Notes on the sheet
- MAY ADD LC FILTER HERE AFTER TESTS WITH THE ONES ORDERED
- Resistance Values will change with output rails
- R1
- (near R43) R2
- R2 = 25-1.25 / (1.25/100 - 65uA)
- R2 = 1909
- Title
- Date:
- RE:
- Arturo di Girolamo
- Size:
- A3
- A

### Library data of the parts
C97 C98 C133 = EEV-FK1H102M: Capacitor, 1mF 50V; Value: .01uf; MFGPN: CL21C101JCANNNC; ASYPN: EEVFK1V152M
C130 = Cap: Capacitor; ASYPN: CL21B104KACNNNC; Published: 8-Jun-2000; LatestRevisionDate: 17-Jul-2002; LatestRevisionNote: Re-released for DXP Platform.; PackageReference: RAD-0.3; Publisher: Altium Limited; PackageDescription: Radial Cap, Thru-Hole; 2 Leads; 0.3 in Pin Spacing
C131 C135 C137 C139-C141 C144 = Cap: Capacitor; ASYPN: C2012X5R1V226M125AC; Published: 8-Jun-2000; LatestRevisionDate: 17-Jul-2002; LatestRevisionNote: Re-released for DXP Platform.; PackageReference: RAD-0.3; Publisher: Altium Limited; PackageDescription: Radial Cap, Thru-Hole; 2 Leads; 0.3 in Pin Spacing
C132 C136 = UVR1V102MHD1TO: as C93 on sheet 5v_Regulator; MFGPN: UVR1V102MHD1TO
C134 = Cap: Capacitor; ASYPN: CL21A225KAFNNNG; Published: 8-Jun-2000; LatestRevisionDate: 17-Jul-2002; LatestRevisionNote: Re-released for DXP Platform.; PackageReference: RAD-0.3; Publisher: Altium Limited; PackageDescription: Radial Cap, Thru-Hole; 2 Leads; 0.3 in Pin Spacing
C138 = Cap: Capacitor; ASYPN: CL21B105KBFNNNG; Published: 8-Jun-2000; LatestRevisionDate: 17-Jul-2002; LatestRevisionNote: Re-released for DXP Platform.; PackageReference: RAD-0.3; Publisher: Altium Limited; PackageDescription: Radial Cap, Thru-Hole; 2 Leads; 0.3 in Pin Spacing
C142 = Cap: Capacitor; ASYPN: 885012207005; Published: 8-Jun-2000; LatestRevisionDate: 17-Jul-2002; LatestRevisionNote: Re-released for DXP Platform.; PackageReference: RAD-0.3; Publisher: Altium Limited; PackageDescription: Radial Cap, Thru-Hole; 2 Leads; 0.3 in Pin Spacing
C143 = Cap: Capacitor; ASYPN: 08055C332KAT2A; Published: 8-Jun-2000; LatestRevisionDate: 17-Jul-2002; LatestRevisionNote: Re-released for DXP Platform.; PackageReference: RAD-0.3; Publisher: Altium Limited; PackageDescription: Radial Cap, Thru-Hole; 2 Leads; 0.3 in Pin Spacing
C160 = CMP-0687-00033-1: Aluminum Electrolytic Capacitor, UD Series, Low Impedance, 22 uF, 50 V, + / - 20%, -55 to 105 degC, Chip Type, 6.3 x 5.8 mm D x L, Pb-Free, Reel; Manufacturer: Nichicon; Impedance: 0.88 Ohm; Rated Ripple Current (at 100kHz): 165 mA; Tolerance Rated Capacitance: -20 to 20%; Rated Capacitance: 22 uF; Endurance Time: 2000 h; Rated Voltage: 50 V; Packing: Dia382mm Reel; PackageReference: CAPAE-D6.3H5.8; ComponentLink3Description: Package Specification; RoHS: TRUE; Diameter: 6.3 mm; ComponentLink1Description: Manufacturer URL; DatasheetVersion: 08/2012; Length: 5.8 mm; ComponentLink2URL: http://products.nichicon.co.jp/en/pdf/XJA043/e-ud.pdf; PartNumber: UUD1H220MCL1GS; Mounting Technology: Surface Mount; ComponentLink2Description: Datasheet; ComponentLink1URL: http://www.nichicon.co.jp/; ComponentLink3URL: http://products.nichicon.co.jp/en/pdf/XJA043/e-ud.pdf; PackageDescription: 2-Pin Surface Mount Device, Diameter 6.3 mm, Height 5.8 mm, Pitch 5.4 mm; ASYPN: UUD1H220MCL1GS
J11 = TFC-103-02-F-D: MF: Samtec; Value: *; Availability: Unavailable; MP: TFC-103-02-F-D; Price: None; Package: None; ASYPN: TFC-103-02-F-D
L2 = IHLP2020BZER100M01: Inductor 10uH VISHAY; MFGPN: IHLP2020BZER100M01; ASYPN: IHLP2020BZER100M01
MP2 = CMP-69313-000002-1: HEATSINK SMT D-PAK/TO-252 TIN; Manufacturer: Aavid Thermalloy; Mating Package: D‐Pak; ComponentLink2URL: https://www.shopaavid.com/images/Product/images/Board%20Level%20Cooling-Surface%20Mount%205731%20v1.pdf; Mouser Description: Heat Sinks SLV HEATSINK TO-252; Octopart: https://octopart.com/573100d00010g-aavid+thermalloy-807578; Category: UNK; Package: 573100D00010G; Manufacturer Part Number: 573100D00010G; ComponentLink2Description: Datasheet; Height: 10.16mm; RoHS: TRUE; Automotive: No; Device Class L1: Electromechanical; Device Class L2: Thermal Management; Lead Free: Yes; Device Class L3: Heat Sinks; Digikey Description: HEATSINK SMT D-PAK/TO-252 TIN
Q2 = PNP: PNP General Purpose Amplifier; Published: 8-Jun-2000; LatestRevisionDate: 15-Jan-2003; LatestRevisionNote: PCB Footprint 'BCY-W3/D4.7' replaced; DatasheetVersion: 1997; PackageVersion: Sep-1998; PackageReference: TO-92A; Publisher: Altium Limited; PackageDescription: TO, Flat Index; 3 In-Line, Axial Leads; Body Dia. 4.5mm; Leads 0.51 x 0.48 mm (max); ComponentLink1Description: Manufacturer Link; ComponentLink1URL: http://www.fairchildsemi.com/; ComponentLink2Description: Datasheet; ComponentLink2URL: http://www.fairchildsemi.com/ds/2N%2F2N3906.pdf
R39 = RR1220P-104-D: 100K 1% 1/10W; Value: 1K; ASYPN: RMCF2512JT100R; MFGPN: RR1220P-104-D
R42 = RNCF0805DTE10R0: 10 ohm 0805; ASYPN: CRCW251210R0FKEG; Value: 10; MFGPN: RNCF0805DTE10R0
R43 = RR1220P-104-D: 100K 1% 1/10W; Value: 1K; ASYPN: ERJ-1TNF1911U; MFGPN: RR1220P-104-D
R44 = Res1: Resistor; ASYPN: RC0805FR-07475KL; Published: 8-Jun-2000; LatestRevisionDate: 17-Jul-2002; LatestRevisionNote: Re-released for DXP Platform.; PackageReference: AXIAL-0.3; Publisher: Altium Limited; PackageDescription: Axial Device, Thru-Hole; 2 Leads; 0.3 in Pin Spacing
R62 = Res1: Resistor; ASYPN: RC0805FR-071K33L; Published: 8-Jun-2000; LatestRevisionDate: 17-Jul-2002; LatestRevisionNote: Re-released for DXP Platform.; PackageReference: AXIAL-0.3; Publisher: Altium Limited; PackageDescription: Axial Device, Thru-Hole; 2 Leads; 0.3 in Pin Spacing
R63 = Res1: Resistor; ASYPN: ERA-6AEB104V; Published: 8-Jun-2000; LatestRevisionDate: 17-Jul-2002; LatestRevisionNote: Re-released for DXP Platform.; PackageReference: AXIAL-0.3; Publisher: Altium Limited; PackageDescription: Axial Device, Thru-Hole; 2 Leads; 0.3 in Pin Spacing
U18 = LT337
U26 = LTC7149IUFD#PBF: Package: None; Price: None; Value: *; MP: LTC7149IUFD#PBF; Availability: Unavailable; ASYPN: LTC7149IUFD#PBF

## Sheet 24V_Regulator.SchDoc: +24V Regulator
size A4; Organization: Altium Limited; Address1: L3, 12a Rodborough Rd; Address2: Frenchs Forest; Address3: NSW; Address4: Australia 2086
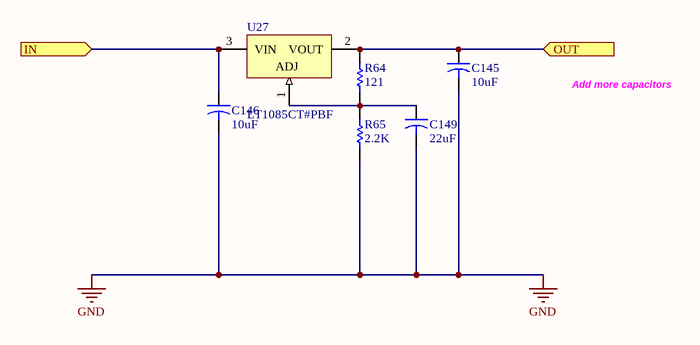
[diagram p31: 24V_Regulator.SchDoc]

### Parts
C145  10uF  [Tantalum_2917]
C146  10uF  [Tantalum_2917]
C149  22uF  [Tantalum_2917]
R64  121  [2512_SMD]
R65  2.2K  [2512_SMD]
U27  LT1085CT#PBF  [LT-T-3]

### Ports
IN (in), OUT (in)

### Nets
GND: C145.2 C146.2 C149.2 R65.1
NetC130_Negative_DC-DC#1_2: C146.1 U27.3(VIN) ; port IN
NetC145_1: C145.1 R64.2 U27.2(VOUT) ; port OUT
NetC149_1: C149.1 R64.1 R65.2 U27.1(ADJ)

### Notes on the sheet
- Add more capacitors
- Title
- Date:
- RE:
- Arturo di Girolamo
- Size:
- A3
- A

### Library data of the parts
C145 C146 = UVR1V102MHD1TO: as C93 on sheet 5v_Regulator; MFGPN: UVR1V102MHD1TO
C149 = UVR1V102MHD1TO: Capacitor, 100uF NICHICON; ASYPN: T496D226K025ATE800; MFGPN: UVR1V102MHD1TO
R64 = RR1220P-104-D: 100K 1% 1/10W; Value: 1K; ASYPN: RMCF2512FT121R; MFGPN: RR1220P-104-D
R65 = RR1220P-104-D: 100K 1% 1/10W; Value: 1K; ASYPN: 35212K2FT; MFGPN: RR1220P-104-D
U27 = CMP-0476-01891-1: 3 A Low Dropout Positive Regulator, 2.55 to 30 V Vin, Adjustable Vout, 3-pin FM (T-3), 0 to 150 degC, Pb-Free; Manufacturer: Linear Technology; Discrete Pass Element: no; Iout(mA): 3000; PSRR(dB): 75; Vout Max(V): 28.5; Vout Min(V): 1.25; Number of Outputs: 1; Vin Max(V): 30; Vin Min(V): 2.55; Dropout Voltage(V): 1.3; Isupply(mA): 5; Output Voltage: Adj; ComponentLink3Description: Package Specification; PackageDescription: 3-Pin Plastic TO-220, Body 10.2235 x 4.3815 mm, Pitch 2.54 mm; ComponentLink2URL: http://cds.linear.com/docs/en/datasheet/108345fg.pdf; DatasheetVersion: Rev. G; PartNumber: LT1085CT#PBF; RoHS: TRUE; ComponentLink1URL: http://www.linear.com/; ComponentLink2Description: Datasheet; Mounting Technology: Through Hole; PackageVersion: Jun-10; ComponentLink1Description: Manufacturer URL; ComponentLink3URL: http://cds.linear.com/docs/en/packaging/TO-220_3_05-08-1420.pdf; PackageReference: T-3

## Sheet 5v_Reg_biggr.SchDoc: 5V Digital regulator
size A4; Organization: Altium Limited; Address1: L3, 12a Rodborough Rd; Address2: Frenchs Forest; Address3: NSW; Address4: Australia 2086
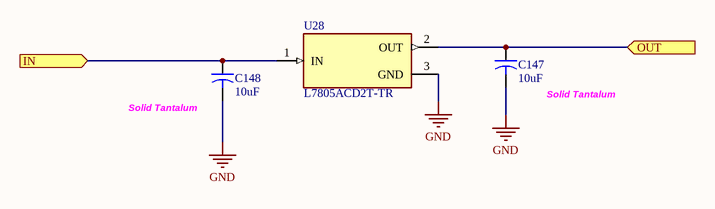
[diagram p32: 5v_Reg_biggr.SchDoc]

### Parts
C147  10uF  [Tantalum_2917]
C148  10uF  [Tantalum_2917]
U28  L7805ACD2T-TR  [TO254P1515X470-3N]

### Ports
IN (in), OUT (in)

### Nets
5Vd: C147.1 U28.2(OUT) ; port OUT
24V: C148.1 U28.1(IN) ; port IN
GND: C147.2 C148.2 U28.3(GND)

### Notes on the sheet
- (near C148) Solid Tantalum
- (near C147) Solid Tantalum
- Title
- Date:
- RE:
- Arturo di Girolamo
- Size:
- A3
- A

### Library data of the parts
C147 C148 = UVR1V102MHD1TO: as C93 on sheet 5v_Regulator; MFGPN: UVR1V102MHD1TO
U28 = L7805ACD2T-TR: Linear Voltage Regulator IC 1 Output 1.5A D2PAK; MF: STMicroelectronics; Price: None; MP: L7805ACD2T-TR; Purchase-URL: https://pricing.snapeda.com/search/part/L7805ACD2T-TR/?ref=eda; Package: D2PAK STMicroelectronics; Check_prices: https://www.snapeda.com/parts/L7805ACD2T-TR/STMicroelectronics/view-part/104395/?ref=eda; SnapEDA_Link: https://www.snapeda.com/parts/L7805ACD2T-TR/STMicroelectronics/view-part/104395/?ref=snap; Value: *; Availability: Good; ASYPN: L7805ACD2T-TR

## Sheet -5v_Reg_biggr.SchDoc: -5V Digital Regulator
size A4; Organization: Altium Limited; Address1: L3, 12a Rodborough Rd; Address2: Frenchs Forest; Address3: NSW; Address4: Australia 2086
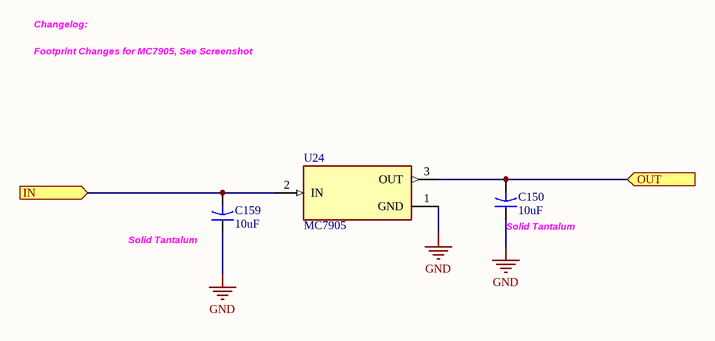
[diagram p33: -5v_Reg_biggr.SchDoc]

### Parts
C150  10uF  [Tantalum_2917]
C159  10uF  [Tantalum_2917]
U24  MC7905  [MC7905]

### Ports
IN (in), OUT (in)

### Nets
-5Vd: C150.2 U24.3(OUT) ; port OUT
-24V_HF: C159.2 U24.2(IN) ; port IN
GND: C150.1 C159.1 U24.1(GND)

### Notes on the sheet
- Changelog:
- Footprint Changes for MC7905, See Screenshot
- (near C159) Solid Tantalum
- (near C150) Solid Tantalum
- Title
- Date:
- RE:
- Arturo di Girolamo
- Size:
- A3
- A

### Library data of the parts
C150 C159 = UVR1V102MHD1TO: as C93 on sheet 5v_Regulator; MFGPN: UVR1V102MHD1TO

## Sheet ZIF_Bridge.SchDoc: Ribbon Bridge
size A4; Organization: Altium Limited; Address1: L3, 12a Rodborough Rd; Address2: Frenchs Forest; Address3: NSW; Address4: Australia 2086
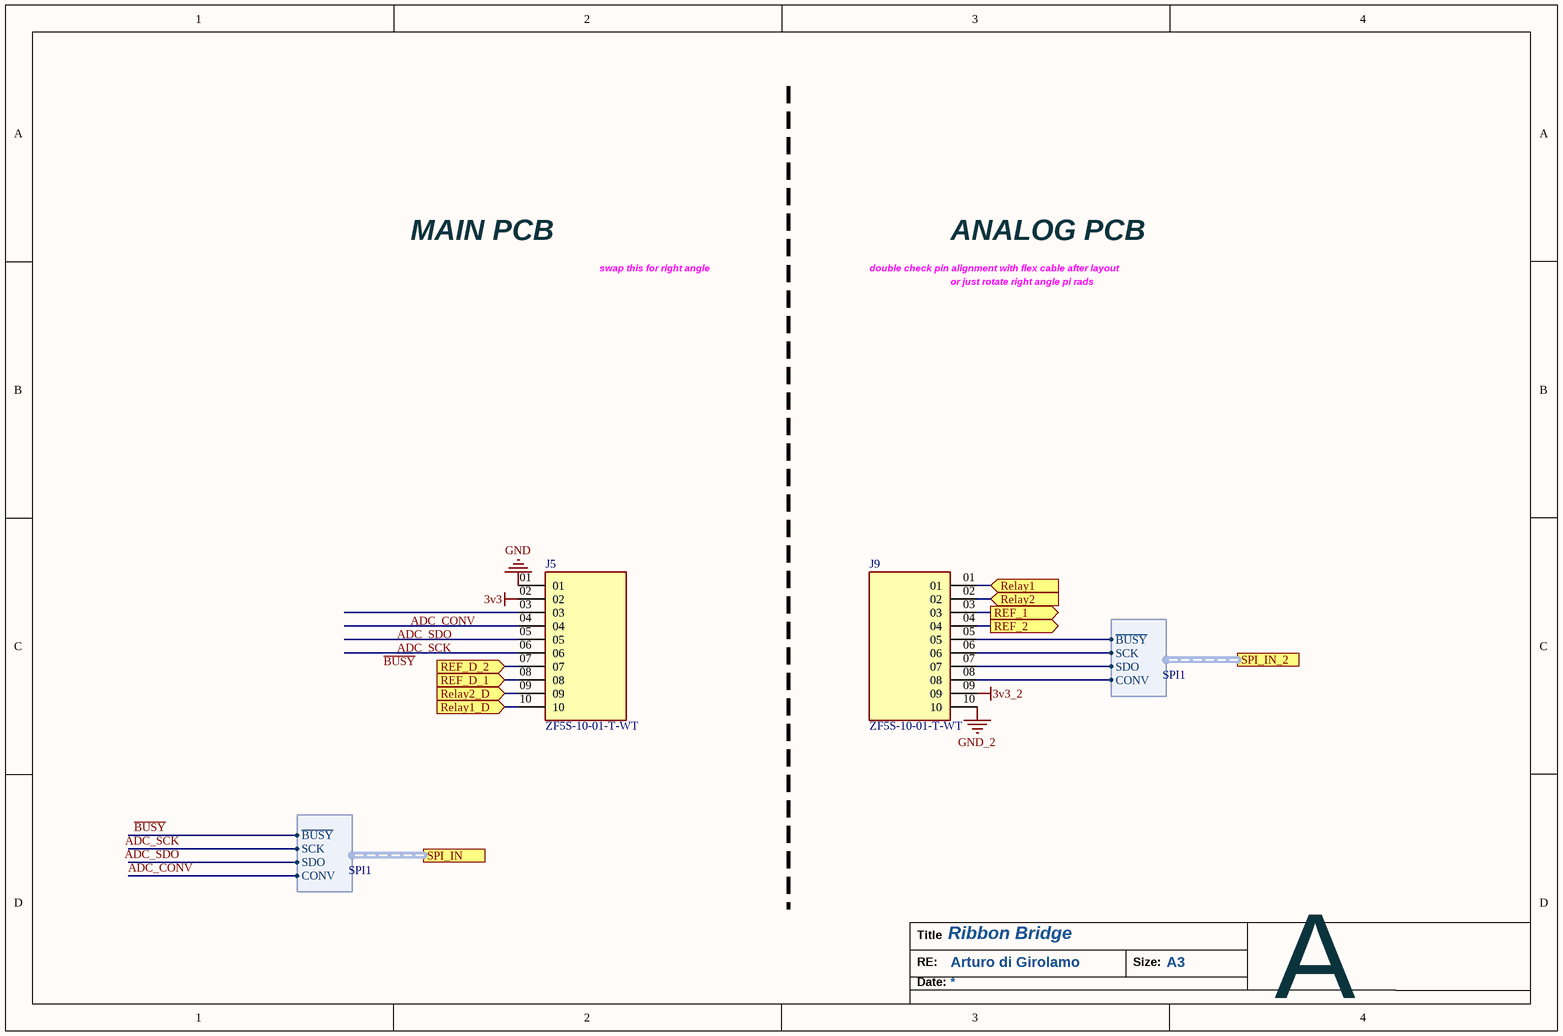
[diagram p34: ZIF_Bridge.SchDoc]

### Parts
J5  ZF5S-10-01-T-WT  [SAMTEC_ZF5S-10-01-T-WT]
J9  ZF5S-10-01-T-WT  [SAMTEC_ZF5S-10-01-T-WT]

### Ports
REF_1 (out), REF_2 (out), REF_D_1 (in), REF_D_2 (in), Relay1 (in), Relay1_D (in), Relay2 (in), Relay2_D (in), SPI_IN (harness SPI1), SPI_IN_2 (harness SPI1)

### Harnesses
SPI1: ~{BUSY}, SCK, CONV, SDO

### Nets
3V3: J5.02
3V3_2: J9.09
GND: J5.01
GND_2: J9.10
ADC_CONV: J5.03 ; port SPI_IN.CONV
ADC_SCK: J5.05 ; port SPI_IN.SCK
ADC_SDO: J5.04 ; port SPI_IN.SDO
~{BUSY}: J5.06 ; port SPI_IN.~{BUSY}
NetJ5_07: J5.07 ; port REF_D_2
NetJ5_08: J5.08 ; port REF_D_1
NetJ5_09: J5.09 ; port Relay2_D
NetJ5_10: J5.10 ; port Relay1_D
NetJ9_01: J9.01 ; port Relay1
NetJ9_02: J9.02 ; port Relay2
NetJ9_03: J9.03 ; port REF_1
NetJ9_04: J9.04 ; port REF_2
NetJ9_05: J9.05 ; port SPI_IN_2.~{BUSY}
NetJ9_06: J9.06 ; port SPI_IN_2.SCK
NetJ9_07: J9.07 ; port SPI_IN_2.SDO
NetJ9_08: J9.08 ; port SPI_IN_2.CONV

### Notes on the sheet
- MAIN PCB
- ANALOG PCB
- swap this for right angle
- double check pin alignment with flex cable after layout
- or just rotate right angle pi rads
- Title
- Date:
- RE:
- Arturo di Girolamo
- Size:
- A3
- A

### Library data of the parts
J5 J9 = ZF5S-10-01-T-WT: Value: *; Price: None; Availability: Unavailable; MP: ZF5S-10-01-T-WT; Package: None; ASYPN: ZF5S-10-01-T-WT

## Sheet 1v8_Regulator.SchDoc: 1.8V Regulator
size A4; Organization: Altium Limited; Address1: L3, 12a Rodborough Rd; Address2: Frenchs Forest; Address3: NSW; Address4: Australia 2086
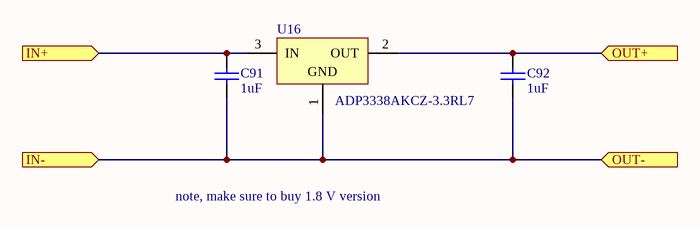
[diagram p35: 1v8_Regulator.SchDoc]

### Parts
C91  1uF  [0402_Cap]
C92  1uF  [0402_Cap]
U16  ADP3338AKCZ-3.3RL7  [ADI-KC-3_M]

### Ports
IN+ (in), IN- (in), OUT+ (in), OUT- (in)

### Nets
1V8d: C92.2 U16.2(OUT) ; port OUT+
5Vd: C91.2 U16.3(IN) ; port IN+
GND: C91.1 C92.1 U16.1(GND) ; port OUT-, port IN-

### Notes on the sheet
- note, make sure to buy 1.8 V version
- Title
- Date:
- RE:
- Arturo di Girolamo
- Size:
- A3
- A

### Library data of the parts
C91 C92 = CL21B105KBFNFNE: Capacitor, 1uF, 0805; Value: .01uf; ASYPN: CL05A105KQ5NNNC; MFGPN: CL21B105KBFNFNE
U16 = CMP-0786-00147-1: High Accuracy, Ultralow IQ, 1 A, anyCAP(R) Low Dropout Regulator, 2.7 to 8 V Vin, 3.3 V Vout, Industrial, 3-pin SOT223 (KC-3), Reel; Manufacturer: Analog Devices; Supply Current IGND @ Small Load: 110uA; Vin (min) (V): 2.7; Preset Vout Values (V): 3.3; Iout max: 1A; Vin (max) (V): 8; ASYPN: ADP3338AKCZ-1.8-R7; PackageDescription: 3-Pin Small Outline Transistor Package, Body 3.5 x 6.5 mm, Pitch 2.3 mm; Code_JEDEC: TO-261-AA; ComponentLink4Description: URL Link1; ComponentLink4URL: Product URL:http://www.analog.com/en/ADP3338/productSearch.html; PackageVersion: 11-20-2012-B, 11/2012; DatasheetVersion: Rev. B; ComponentLink3URL: http:/www.analog.com/static/imported-files/packages/PKG_PDF/SOT_223(KC)/KC_3.pdf; Mounting Technology: Surface Mount; ComponentLink2URL: http://www.analog.com/static/imported-files/data_sheets/ADP3338.pdf; PartNumber: ADP3338AKCZ-3.3RL7; ComponentLink2Description: Datasheet; ComponentLink3Description: Package Specification; ComponentLink1Description: Manufacturer URL; Packing: Reel; PackageReference: KC-3; ComponentLink1URL: http://www.analog.com/en/index.html

## Sheet 5kHZ_LO_LPF.SchDoc: 5kHz AD630 LPF
size A4; Organization: Altium Limited; Address1: L3, 12a Rodborough Rd; Address2: Frenchs Forest; Address3: NSW; Address4: Australia 2086
Used 3 times, as channels LO1_LPF, LO1_HPF, LO2_HPF. Parts and nets are listed once, with the designators drawn on the sheet.
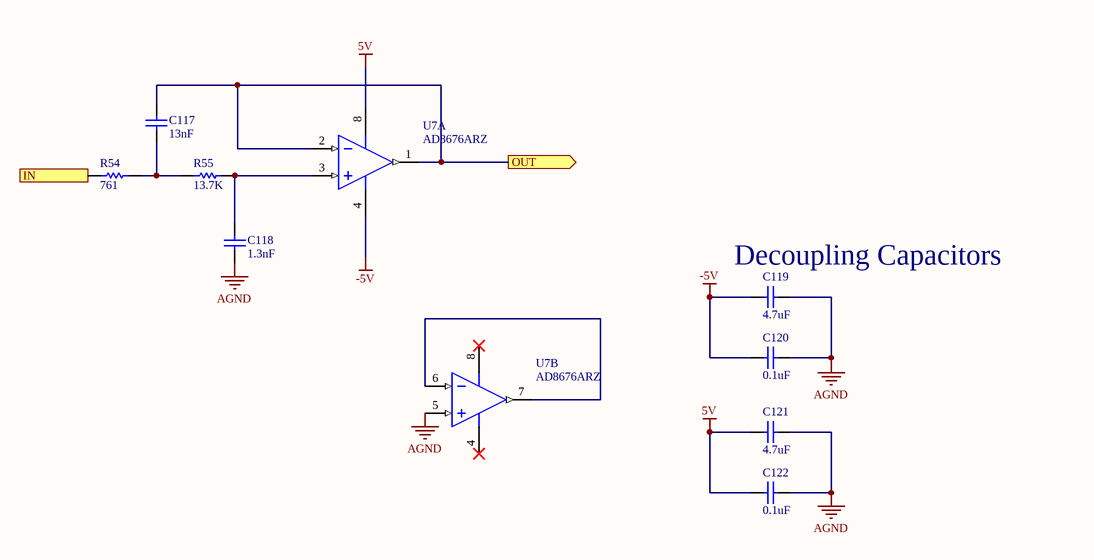
[diagram p36: 5kHZ_LO_LPF.SchDoc]

### Parts
C117  13nF  [0402_Cap]
C118  1.3nF  [0402_Cap]
C119  4.7uF  [0402_Cap]
C120  0.1uF  [0402_Cap]
C121  4.7uF  [0402_Cap]
C122  0.1uF  [0402_Cap]
R54  761  [0402_Res]
R55  13.7K  [0402_Res]
U7  AD8676ARZ  [ADI-R-8_M]  (parts A,B of 2)

### Ports
IN (in), OUT (out)

### Nets
5V: C121.1 C122.1 U7.8(+V)
-5V: C119.1 C120.1 U7.4(-V)
AGND: C118.1 C119.2 C120.2 C121.2 C122.2 U7.5(+IN_B)
IN: R54.1 ; port IN
OUT: C117.2 U7.1(OUT_A) U7.2(-IN_A) ; port OUT
NetC117_1: C117.1 R54.2 R55.1
NetC118_2: C118.2 R55.2 U7.3(+IN_A)
NetU7_6: U7.6(-IN_B) U7.7(OUT_B)

### Channels
LO1_LPF: designators end in _LO1_LPF; ports IN=NetC117_LO1_HPF_2 OUT=NetC117_LO1_LPF_2
LO1_HPF: designators end in _LO1_HPF; ports IN=NetJ9_04 OUT=NetC117_LO1_HPF_2
LO2_HPF: designators end in _LO2_HPF; ports IN=NetJ9_03 OUT=NetC117_LO2_HPF_2

### Notes on the sheet
- (near C119) Decoupling Capacitors
- Title
- Date:
- RE:
- Arturo di Girolamo
- Size:
- A3
- A

### Library data of the parts
C117 = 08051C163JAT2A: Capacitor, 16nF, 0805, 25V; ASYPN: C0402C123K8PACTU; Value: 16nF; MFGPN: 08051C163JAT2A
C118 = GRM2165C2A162JA01D: Capacitor, 1.6nF, 0805, 25V; ASYPN: GRM1557U1A122JA01D; Value: 1.6nF; MFGPN: GRM2165C2A162JA01D
C119 C121 = CL21A475KAQNNNE: Capacitor, 4.7uF, 0805; Value: .01uf; ASYPN: GRM155R61A475MEAAD; MFGPN: CL21A475KAQNNNE
C120 C122 = CL21B104KACNNNC: Capacitor, 0.1uF, 0805; Value: .01uf; ASYPN: 0402YC104KAT2A; MFGPN: CL21B104KACNNNC
R54 = RC0805FR-071K65L: 1.65k; ASYPN: ERA-2AEB7680X; Value: 1.65k; MFGPN: RC0805FR-071K65L
R55 = RC0805FR-075K9L: 5.9k; ASYPN: RMCF0402FT13K7; Value: 5.9k; MFGPN: RC0805FR-075K9L
U7 = CMP-0384-01145-2: Double Channel Wide Bandwidth Operational Amplifier, 10 MHz BW, 2.5 V/us SR, Industrial, 8-pin SOIC (R-8), Tube; Generic Part Number: AD8676; Manufacturer: Analog Devices; Input Offset Voltage: 12uV; Input Bias Current: 2.4nA; V Span Min: 10V; Iq/Amp: 2.7mA; V Span Max: 36V; Small Signal Bandwidth: 10MHz; Amplifiers Per Package: 2; Code_JEDEC: MS-012-AA; Mounting Technology: Surface Mount; Slew Rate: 2.5V/us; DatasheetVersion: Rev. C; ComponentLink2Description: Datasheet; ComponentLink3Description: Package Specification; PackageReference: R-8; ComponentLink1URL: http://www.analog.com/en/index.html; RevisionNote: Reference Circuit URL fixed; ComponentLink1Description: Manufacturer URL; ComponentLink2URL: http://www.analog.com/static/imported-files/data_sheets/AD8676.pdf; ComponentLink3URL: http://www.analog.com/static/imported-files/packages/PKG_PDF/SOIC_Narrow%20(R)/R_8.pdf; ComponentLink4Description: Reference Circuit; ComponentLink4URL: http://www.analog.com/en/all-operational-amplifiers-op-amps/operational-amplifiers-op-amps/ad8676/products/product.html#product-recommendations; PackageDescription: 8-Pin Standard Small Outline Package, Body 3.9 x 4.9 mm, Pitch 1.27 mm; PartNumber: AD8676ARZ; PackageVersion: 060506-A; ASYPN: AD8676ARZ

## Sheet 600Hz_LO_LPF.SchDoc: LF AD630 LPF
size A4; Organization: Altium Limited; Address1: L3, 12a Rodborough Rd; Address2: Frenchs Forest; Address3: NSW; Address4: Australia 2086
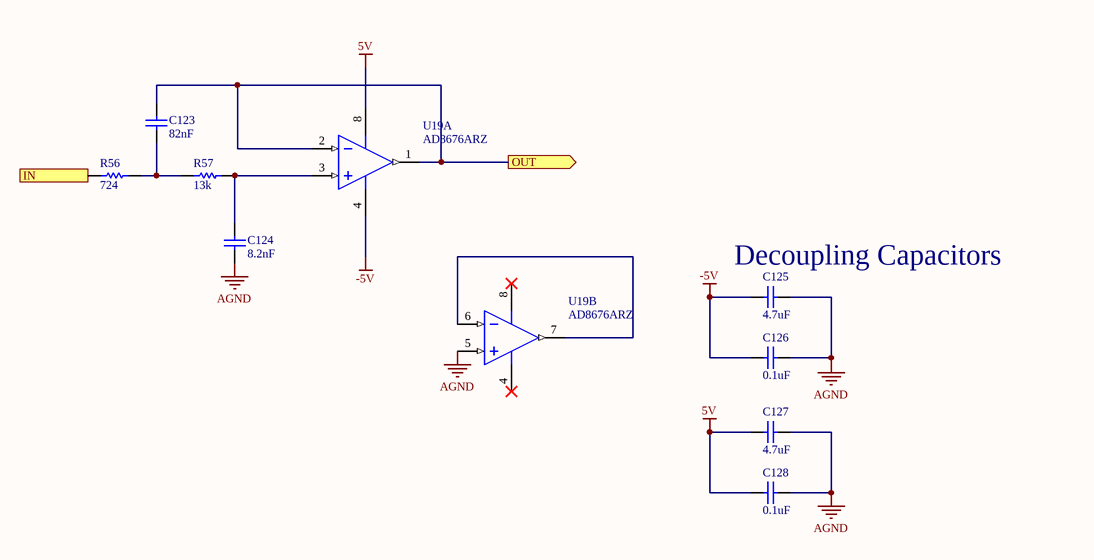
[diagram p37: 600Hz_LO_LPF.SchDoc]

### Parts
C123  82nF  [0402_Cap]
C124  8.2nF  [0402_Cap]
C125  4.7uF  [0402_Cap]
C126  0.1uF  [0402_Cap]
C127  4.7uF  [0402_Cap]
C128  0.1uF  [0402_Cap]
R56  724  [0402_Res]
R57  13k  [0402_Res]
U19  AD8676ARZ  [ADI-R-8_M]  (parts A,B of 2)

### Ports
IN (in), OUT (out)

### Nets
5V: C127.1 C128.1 U19.8(+V)
-5V: C125.1 C126.1 U19.4(-V)
AGND: C124.1 C125.2 C126.2 C127.2 C128.2 U19.5(+IN_B)
NetC117_LO2_HPF_2: R56.1 ; port IN
NetC123_1: C123.1 R56.2 R57.1
NetC123_2: C123.2 U19.1(OUT_A) U19.2(-IN_A) ; port OUT
NetC124_2: C124.2 R57.2 U19.3(+IN_A)
NetU19_6: U19.6(-IN_B) U19.7(OUT_B)

### Notes on the sheet
- (near C125) Decoupling Capacitors
- Title
- Date:
- RE:
- Arturo di Girolamo
- Size:
- A3
- A

### Library data of the parts
C123 = 08051C163JAT2A: Capacitor, 16nF, 0805, 25V; ASYPN: GRM155R61A823KA01D; Value: 16nF; MFGPN: 08051C163JAT2A
C124 = GRM2165C2A162JA01D: Capacitor, 1.6nF, 0805, 25V; ASYPN: 0402B103K6R3CT; Value: 1.6nF; MFGPN: GRM2165C2A162JA01D
C125 C127 = CL21A475KAQNNNE: as C119 on sheet 5kHZ_LO_LPF; MFGPN: CL21A475KAQNNNE
C126 C128 = CL21B104KACNNNC: as C120 on sheet 5kHZ_LO_LPF; MFGPN: CL21B104KACNNNC
R56 = RC0805FR-071K65L: 1.65k; ASYPN: RMCF0402FT715R; Value: 1.65k; MFGPN: RC0805FR-071K65L
R57 = RC0805FR-075K9L: 5.9k; ASYPN: RMCF0402FT13K0; Value: 5.9k; MFGPN: RC0805FR-075K9L
U19 = CMP-0384-01145-2: as U7 on sheet 5kHZ_LO_LPF; Code_JEDEC: MS-012-AA; Mounting Technology: Surface Mount; Slew Rate: 2.5V/us; DatasheetVersion: Rev. C; ComponentLink2Description: Datasheet; ComponentLink3Description: Package Specification; PackageReference: R-8; ComponentLink1URL: http://www.analog.com/en/index.html; RevisionNote: Reference Circuit URL fixed; ComponentLink1Description: Manufacturer URL; ComponentLink2URL: http://www.analog.com/static/imported-files/data_sheets/AD8676.pdf; ComponentLink3URL: http://www.analog.com/static/imported-files/packages/PKG_PDF/SOIC_Narrow%20(R)/R_8.pdf; ComponentLink4Description: Reference Circuit; ComponentLink4URL: http://www.analog.com/en/all-operational-amplifiers-op-amps/operational-amplifiers-op-amps/ad8676/products/product.html#product-recommendations; PackageDescription: 8-Pin Standard Small Outline Package, Body 3.9 x 4.9 mm, Pitch 1.27 mm; PartNumber: AD8676ARZ; PackageVersion: 060506-A; ASYPN: AD8676ARZ